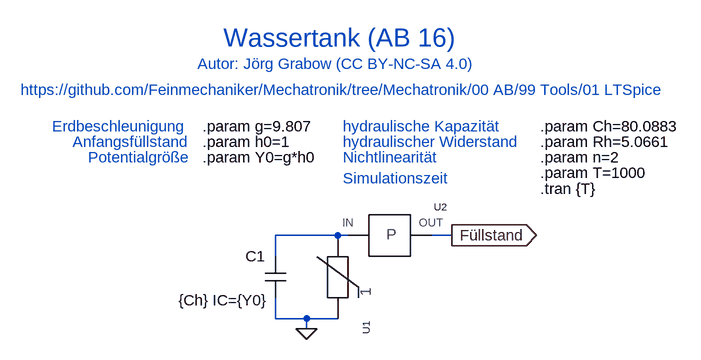
[diagram p0: schematic LAB_16.asc]
LAB_16.asc, the LTspice schematic file:
Version 4
SHEET 1 880 680
WIRE 128 144 32 144
WIRE 144 144 128 144
WIRE 304 144 272 144
WIRE 32 176 32 144
WIRE 32 272 32 240
WIRE 80 272 32 272
WIRE 128 272 80 272
WIRE 80 288 80 272
FLAG 80 288 0
FLAG 304 144 Füllstand
IOPIN 304 144 Out
SYMBOL cap 16 176 R0
WINDOW 3 -133 68 Left 2
WINDOW 0 -30 0 Left 2
SYMATTR Value {Ch} IC={Y0}
SYMATTR InstName C1
SYMBOL Mechatronik\\Spezial\\RL1 128 192 R90
SYMATTR SpiceLine RL1={Rh}
SYMATTR SpiceLine2 n={n}
SYMATTR InstName U1
SYMBOL P-Glied 208 144 R0
SYMATTR SpiceLine Kp=1/{g}
SYMATTR InstName U2
TEXT 440 72 Left 2 !.tran {T}
TEXT 440 -24 Left 2 !.param Ch=80.0883
TEXT -80 24 Left 2 !.param Y0=g*h0
TEXT -80 -24 Left 2 !.param g=9.807
TEXT -80 0 Left 2 !.param h0=1
TEXT 440 0 Left 2 !.param Rh=5.0661
TEXT 440 24 Left 2 !.param n=2
TEXT -48 -160 Left 4 ;Wassertank (AB 16)
TEXT -360 -80 Left 2 ;https://github.com/Feinmechaniker/Mechatronik/tree/Mechatronik/00 AB/99 Tools/01 LTSpice
TEXT -88 -120 Left 2 ;Autor: Jörg Grabow (CC BY-NC-SA 4.0)
TEXT -312 -24 Left 2 ;Erdbeschleunigung
TEXT -280 0 Left 2 ;Anfangsfüllstand
TEXT 136 -24 Left 2 ;hydraulische Kapazität
TEXT 136 0 Left 2 ;hydraulischer Widerstand
TEXT 136 24 Left 2 ;Nichtlinearität
TEXT -256 24 Left 2 ;Potentialgröße
TEXT 136 56 Left 2 ;Simulationszeit
TEXT 440 48 Left 2 !.param T=1000

The netlist it stands for:
* LAB_16.asc
C1 N001 0 {Ch} IC={Y0}
XU1 N001 0 RL1 RL1={Rh} n={n}  ; pins 1 2
XU2 N001 Füllstand P-Glied Kp=1/{g}  ; pins IN OUT
.tran {T}
.param Ch=80.0883
.param Y0=g*h0
.param g=9.807
.param h0=1
.param Rh=5.0661
.param n=2
* Wassertank (AB 16)
* https://github.com/Feinmechaniker/Mechatronik/tree/Mechatronik/00 AB/99 Tools/01 LTSpice
* Autor: Jörg Grabow (CC BY-NC-SA 4.0)
* Erdbeschleunigung
* Anfangsfüllstand
* hydraulische Kapazität
* hydraulischer Widerstand
* Nichtlinearität
* Potentialgröße
* Simulationszeit
.param T=1000
.lib Mechatronik.lib
.lib Control.lib
.backanno
.end